# Altium schematic sheet LED_MATRIX.SchDoc
size A4; SheetNumber: 11; SheetTotal: 12
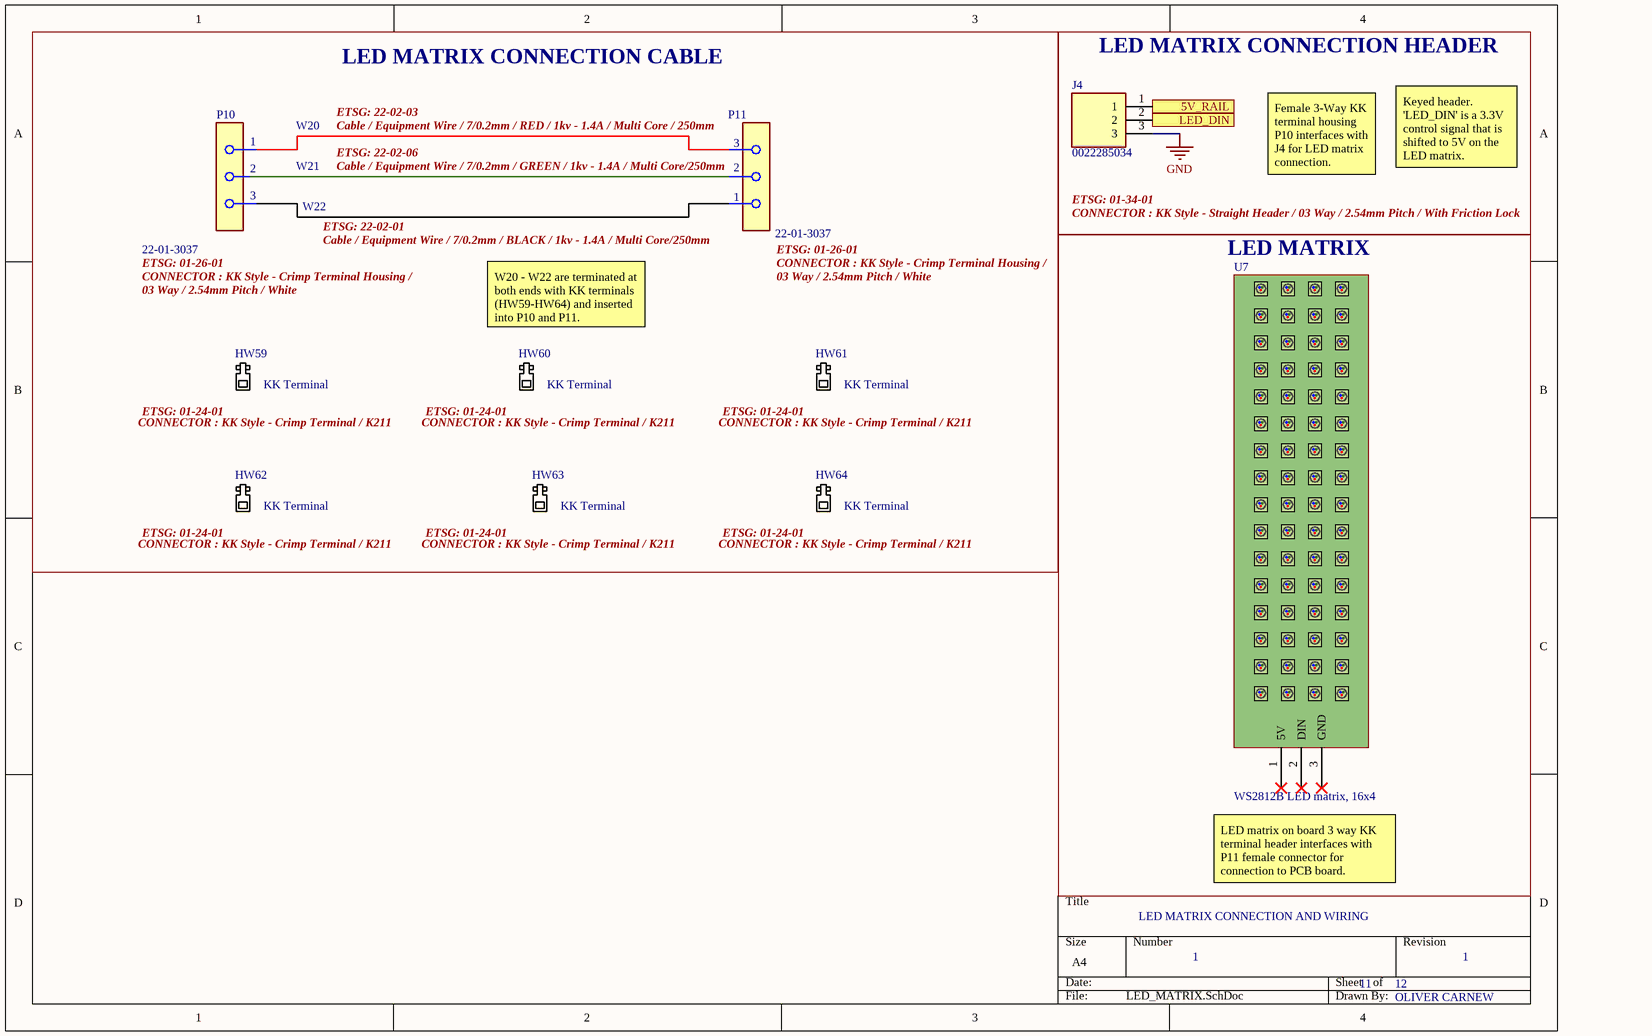
[diagram p0: LED_MATRIX.SchDoc]

## Parts
HW59  KK Terminal
HW60  KK Terminal
HW61  KK Terminal
HW62  KK Terminal
HW63  KK Terminal
HW64  KK Terminal
J4  0022285034  [0022285034]
P10  22-01-3037  [FP-22-01-3037-MFG]
P11  22-01-3037  [FP-22-01-3037-MFG]
U7  WS2812B LED matrix, 16x4

## Blocks framed on the sheet
LED MATRIX CONNECTION CABLE: HW59-HW64 P10 P11
LED MATRIX CONNECTION HEADER: J4
LED MATRIX: U7

## Ports
5V_RAIL, LED_DIN

## Nets
GND: J4.3
5V_RAIL: J4.1 ; port 5V_RAIL
LED_DIN: J4.2 ; port LED_DIN

Not connected (* = marked no-connect by the designer): U7 1(5V)* 2(DIN)* 3(GND)*

## Notes on the sheet
- ETSG: 22-02-03
- (near P10) 1
- (near P10) 2
- W20
- W21
- (near P11) Cable / Equipment Wire / 7/0.2mm / RED / 1kv - 1.4A / Multi Core / 250mm
- ETSG: 22-02-06
- (near P11) Cable / Equipment Wire / 7/0.2mm / GREEN / 1kv - 1.4A / Multi Core/250mm
- (near P11) 2
- (near P11) 3
- Female 3-Way KK terminal housing P10 interfaces with J4 for LED matrix connection.
- Keyed header. 'LED_DIN' is a 3.3V control signal that is shifted to 5V on the LED matrix.
- (near P10) 3
- W22
- ETSG: 22-02-01
- Cable / Equipment Wire / 7/0.2mm / BLACK / 1kv - 1.4A / Multi Core/250mm
- (near P11) 1
- ETSG: 01-34-01
- CONNECTOR : KK Style - Straight Header / 03 Way / 2.54mm Pitch / With Friction Lock
- ETSG: 01-26-01
- CONNECTOR : KK Style - Crimp Terminal Housing /
- 03 Way / 2.54mm Pitch / White
- (near HW60) W20 - W22 are terminated at both ends with KK terminals (HW59-HW64) and inserted into P10 and P11.
- CONNECTOR : KK Style - Crimp Terminal / K211
- (near HW59) ETSG: 01-24-01
- (near HW60) ETSG: 01-24-01
- (near HW61) ETSG: 01-24-01
- (near HW62) CONNECTOR : KK Style - Crimp Terminal / K211
- (near HW62) ETSG: 01-24-01
- (near HW63) CONNECTOR : KK Style - Crimp Terminal / K211
- (near HW63) ETSG: 01-24-01
- (near HW64) CONNECTOR : KK Style - Crimp Terminal / K211
- (near HW64) ETSG: 01-24-01
- LED MATRIX CONNECTION AND WIRING
- LED matrix on board 3 way KK terminal header interfaces with P11 female connector for connection to PCB board.
- 1
- 11
- 12
- OLIVER CARNEW

## Library data of the parts
HW59-HW64 = SPH-002T-P0.5S: CONNECTOR : KK Style - Crimp Terminal Housing / 03 Way / 2.54mm Pitch / White / ETSG 01-26-01
J4 = 0022285034: Connector; Manufacturer_Name: Molex; Datasheet Link: https://www.molex.com/content/dam/molex/molex-dot-com/products/automated/en-us/salesdrawingpdf/423/42375/022285034_sd.pdf?inline; Height: 10.67mm; Manufacturer_Part_Number: 0022285034; Arrow Part Number: 0022285034; Arrow Price/Stock: https://www.arrow.com/en/products/0022285034/molex?utm_currency=USD&region=nac
P10 P11 = CMP-04776-000467-1: CONN HOUS 3POS .100 W/RAMP/RIB; Number of Circuits: 3; Max Current Rating: 4A; Glow Wire Compliant: Non-compliant; Gender: Female; Connector Type: Receptacle; Approvals: UL; Voltage Rating: 250V; Pitch: 2.54mm; Halogen Free: Low Halogen; Length: 8.18mm; Depth: 12.7mm; Housing Material: Nylon; Number of Rows: 1; Termination: Crimp; Height: 4.82mm; Orientation: Straight; Housing Color: White; Material: Nylon; Max Operating Temperature: 75°C; Fastening Type: Ramp; Radiation Hardening: No; Lead Free: Lead Free; Flammability Rating: UL94 V-0; Series: 2695; Min Operating Temperature: 0°C; Number of Contacts: 3; Packaging: Bulk; Contact Material: Bronze; Number of Positions: 3; Color: White; Contact Type: Non-Gendered; Mount: Free Hanging; Width: 4.82mm
U7 = LED_MATRIX